# EAGLE schematic fab-chariot-elevateur (EAGLE 9.2.2)

## Sheet 1 of 3
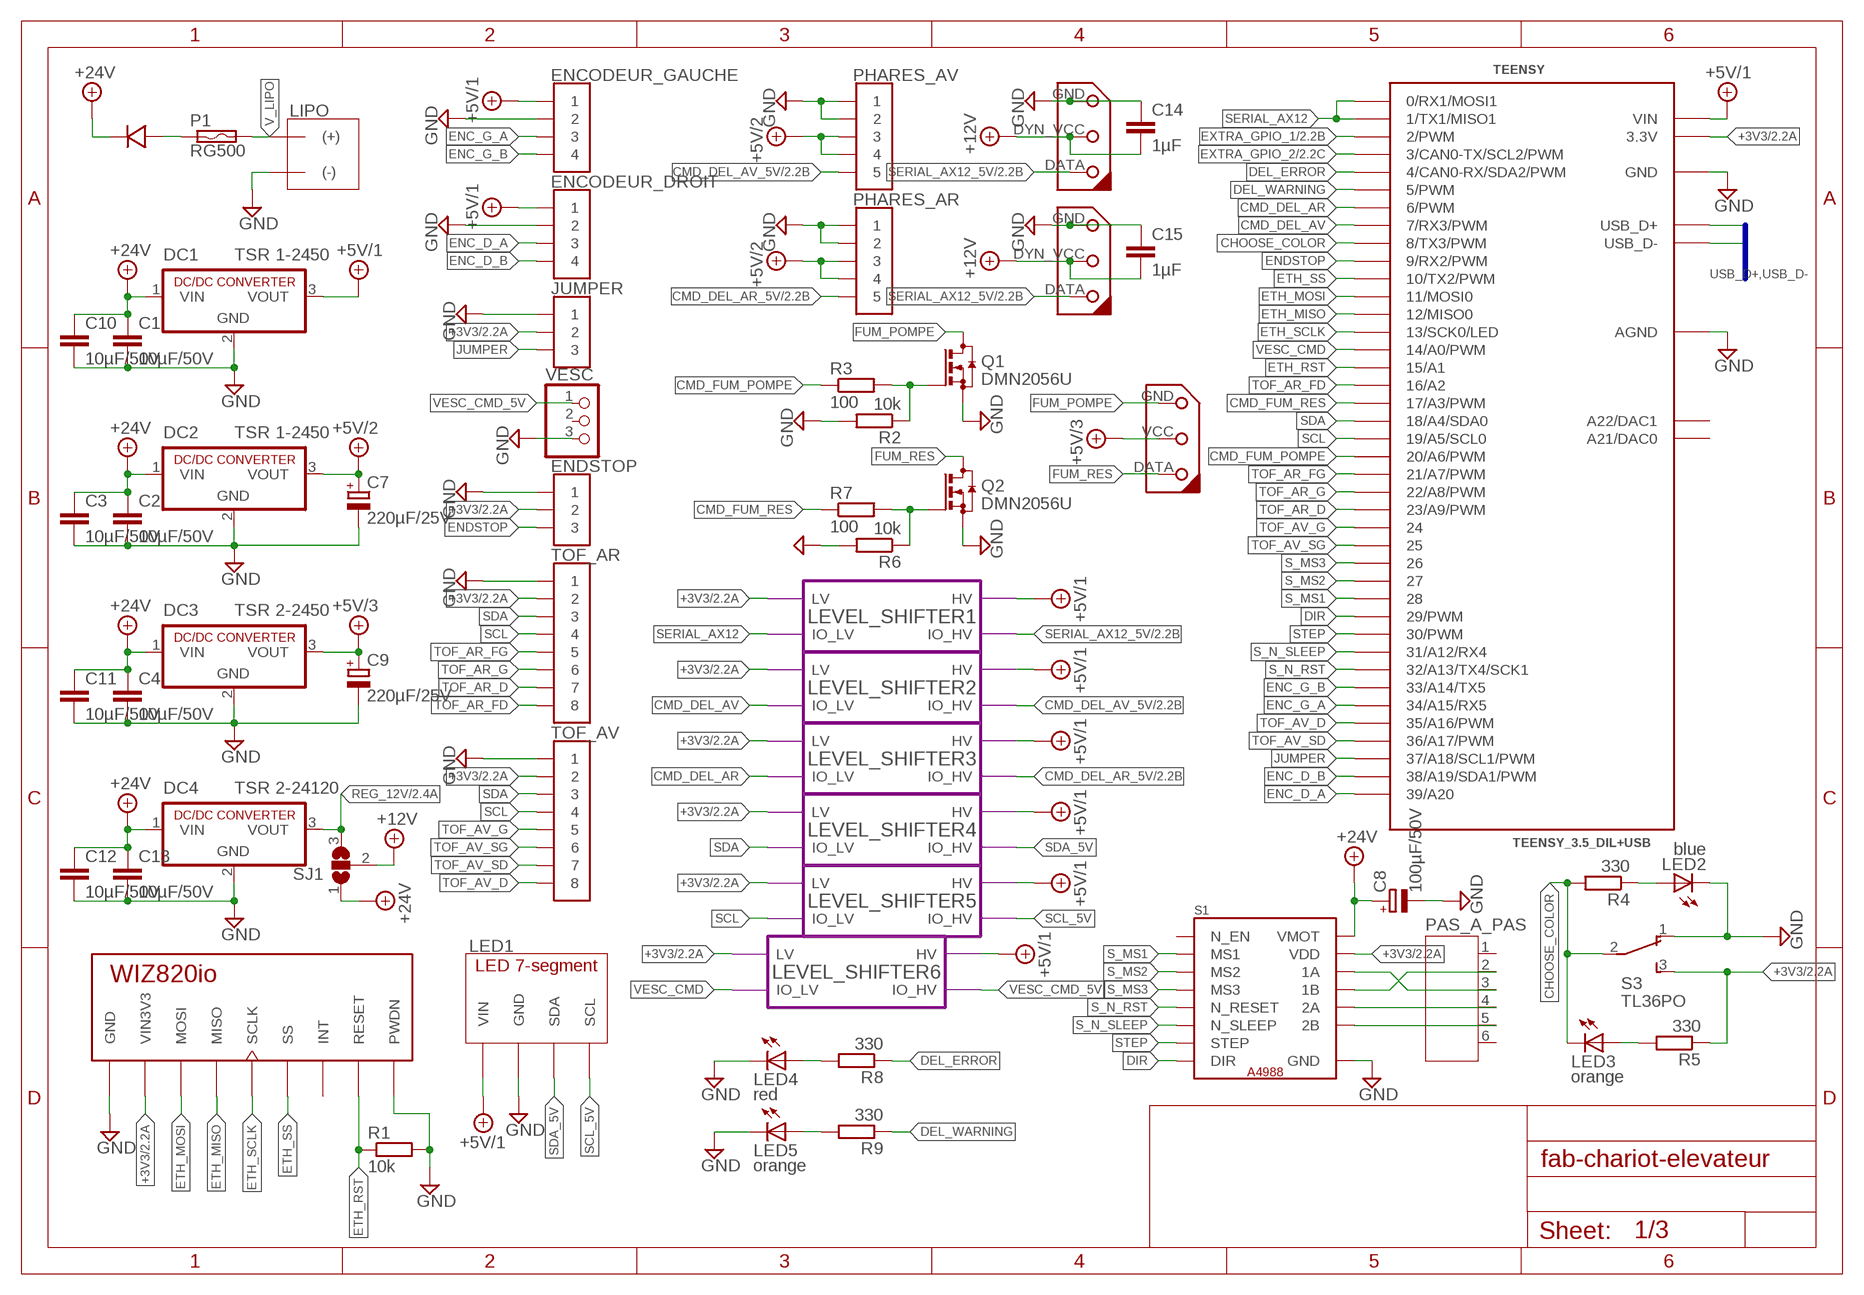
[diagram p0: schematic, sheet 1]

### Parts
AX12_AR  DYNAMIXEL-1X03AX  [DYNAMIXEL_AX_1X03]
AX12_AV  DYNAMIXEL-1X03AX  [DYNAMIXEL_AX_1X03]
C1  10µF/50V  C-EUC1210  [C1210]
C2  10µF/50V  C-EUC1210  [C1210]
C3  10µF/50V  C-EUC1210  [C1210]
C4  10µF/50V  C-EUC1210  [C1210]
C7  220µF/25V  CPOL-EUE3.5-8  [E3,5-8]
C8  100µF/50V  CPOL-EUE3.5-8  [E3,5-8]
C9  220µF/25V  CPOL-EUE3.5-8  [E3,5-8]
C10  10µF/50V  C-EUC1210  [C1210]
C11  10µF/50V  C-EUC1210  [C1210]
C12  10µF/50V  C-EUC1210  [C1210]
C13  10µF/50V  C-EUC1210  [C1210]
C14  1µF  C-EUC0805  [C0805]
C15  1µF  C-EUC0805  [C0805]
D1  DIODE_S15P45  [TO-277A]
DC1  TSR 1-2450  R-78C5.0-1.0  [SIP3]
DC2  TSR 1-2450  R-78C5.0-1.0  [SIP3]
DC3  TSR 2-2450  R-78C5.0-1.0  [SIP3]
DC4  TSR 2-24120  R-78C12-1.0  [SIP3]
ENCODEUR_DROIT  JST-04GH-V  [GH-04-V]
ENCODEUR_GAUCHE  JST-04GH-V  [GH-04-V]
ENDSTOP  JST-03  [GH-03-V]
FUMIGENE  DYNAMIXEL-1X03XL  [DYNAMIXEL_XL_1X03]
JUMPER  JST-03  [GH-03-V]
LED1  ADAFRUIT_7-SEGMENT-LED  [0.56"LED_BACKPACK]
LED2  blue  LEDSMT1206  [1206]
LED3  orange  LEDSMT1206  [1206]
LED4  red  LED3MM  [LED3MM]
LED5  orange  LED3MM  [LED3MM]
LIPO  XT-60  [XT-60]
P1  RG500  RGEF800  [5MM]
PAS_A_PAS  JST-PH6  [JST-PH6]
PHARES_AR  JST-05  [GH-05-V]
PHARES_AV  JST-05  [GH-05-V]
Q1  DMN2056U  BSS123  [SOT23]
Q2  DMN2056U  BSS123  [SOT23]
R1  10k  R-EU_R0805  [R0805]
R2  10k  R-EU_R0805  [R0805]
R3  100  R-EU_R0805  [R0805]
R4  330  R-EU_R0805  [R0805]
R5  330  R-EU_R0805  [R0805]
R6  10k  R-EU_R0805  [R0805]
R7  100  R-EU_R0805  [R0805]
R8  330  R-EU_R0805  [R0805]
R9  330  R-EU_R0805  [R0805]
S1  A4988-BREAKOUT  [A4988-BREAKOUT]
S3  TL36PO  [TL3XPO]
SJ1  SJ2W  [SJ_2]
TEENSY  TEENSY_3.5_DIL+USB  [TEENSY_3.5_DIL+USB]
TOF_AR  JST-08  [GH-08-V]
TOF_AV  JST-08  [GH-08-V]
U1  WIZ820IO  [WIZ820]
VESC  PINHD-1X3/90  [1X03/90]

### Module instances
LEVEL_SHIFTER1 = LEVEL_SHIFTER
LEVEL_SHIFTER2 = LEVEL_SHIFTER
LEVEL_SHIFTER3 = LEVEL_SHIFTER
LEVEL_SHIFTER4 = LEVEL_SHIFTER
LEVEL_SHIFTER5 = LEVEL_SHIFTER
LEVEL_SHIFTER6 = LEVEL_SHIFTER

### Nets
+3V3 [1A]: ENDSTOP.2 JUMPER.2 R5.1 S1.VDD S3.3(S) TEENSY.3.3V TEENSY.3.3V3(3.3V) TOF_AR.2 TOF_AV.2 U1.VIN1(VIN3V3) U1.VIN2(VIN3V3) ; port LEVEL_SHIFTER1.LV LEVEL_SHIFTER2.LV LEVEL_SHIFTER3.LV LEVEL_SHIFTER4.LV LEVEL_SHIFTER5.LV LEVEL_SHIFTER6.LV ; also sheet 2
+5V/1 [1A]: DC1.3(VOUT) ENCODEUR_DROIT.1 ENCODEUR_GAUCHE.1 LED1.VCC(VIN) TEENSY.VIN ; port LEVEL_SHIFTER1.HV LEVEL_SHIFTER4.HV LEVEL_SHIFTER5.HV LEVEL_SHIFTER6.HV LEVEL_SHIFTER2.HV LEVEL_SHIFTER3.HV ; also sheet 2
+5V/2 [2A]: C7.+ DC2.3(VOUT) PHARES_AR.3 PHARES_AR.4 PHARES_AV.3 PHARES_AV.4 ; also sheet 2
+5V/3 [2A]: C9.+ DC3.3(VOUT) FUMIGENE.VCC(DYN_VCC) ; also sheet 2
+12V [2A]: AX12_AR.DYN_VCC AX12_AV.DYN_VCC C14.2 C15.2 SJ1.2 ; also sheet 2
+24V [1A]: C1.1 C2.1 C3.1 C4.1 C8.+ C10.1 C11.1 C12.1 C13.1 D1.- DC1.1(VIN) DC2.1(VIN) DC3.1(VIN) DC4.1(VIN) S1.VMOT SJ1.1 ; also sheet 2
CHOOSE_COLOR: LED3.C R4.2 S3.2(P) TEENSY.8(8/TX3/PWM)
CMD_DEL_AR: TEENSY.6(6/PWM) ; port LEVEL_SHIFTER3.IO_LV
CMD_DEL_AR_5V: PHARES_AR.5 ; port LEVEL_SHIFTER3.IO_HV ; also sheet 2
CMD_DEL_AV: TEENSY.7(7/RX3/PWM) ; port LEVEL_SHIFTER2.IO_LV
CMD_DEL_AV_5V: PHARES_AV.5 ; port LEVEL_SHIFTER2.IO_HV ; also sheet 2
CMD_FUM_POMPE: R3.1 TEENSY.20/A6(20/A6/PWM)
CMD_FUM_RES: R7.1 TEENSY.17/A3(17/A3/PWM)
DEL_ERROR: R8.1 TEENSY.4(4/CAN0-RX/SDA2/PWM)
DEL_WARNING: R9.1 TEENSY.5(5/PWM)
DIR: S1.DIR TEENSY.29(29/PWM)
ENC_D_A: ENCODEUR_DROIT.3 TEENSY.39/A20
ENC_D_B: ENCODEUR_DROIT.4 TEENSY.38/A19(38/A19/SDA1/PWM)
ENC_G_A: ENCODEUR_GAUCHE.3 TEENSY.34/A15(34/A15/RX5)
ENC_G_B: ENCODEUR_GAUCHE.4 TEENSY.33/A14(33/A14/TX5)
ENDSTOP: ENDSTOP.3 TEENSY.9(9/RX2/PWM)
ETH_MISO: TEENSY.12(12/MISO0) U1.MISO
ETH_MOSI: TEENSY.11(11/MOSI0) U1.MOSI
ETH_RST: R1.1 TEENSY.15/A1 U1.RESET
ETH_SCLK: TEENSY.13(13/SCK0/LED) U1.SCLK
ETH_SS: TEENSY.10(10/TX2/PWM) U1.SS
EXTRA_GPIO_1: TEENSY.2(2/PWM) ; also sheet 2
EXTRA_GPIO_2: TEENSY.3(3/CAN0-TX/SCL2/PWM) ; also sheet 2
FUM_POMPE [2A]: FUMIGENE.GND Q1.3(D)
FUM_RES [2A]: FUMIGENE.DATA Q2.3(D)
GND: AX12_AR.GND AX12_AV.GND C1.2 C2.2 C3.2 C4.2 C7.- C8.- C9.- C10.2 C11.2 C12.2 C13.2 C14.1 C15.1 DC1.2(GND) DC2.2(GND) DC3.2(GND) DC4.2(GND) ENCODEUR_DROIT.2 ENCODEUR_GAUCHE.2 ENDSTOP.1 JUMPER.1 LED1.GND LED2.C LED4.K(C) LED5.K(C) LIPO.(-) PHARES_AR.1 PHARES_AR.2 PHARES_AV.1 PHARES_AV.2 Q1.2(S) Q2.2(S) R1.2 R2.2 R6.2 S1.GND1(GND) S1.GND2(GND) S3.1(O) TEENSY.AGND TEENSY.GND TEENSY.GND1(GND) TOF_AR.1 TOF_AV.1 U1.GND1(GND) U1.GND2(GND) U1.GND3(GND) U1.PWDN VESC.3 ; also sheet 2
JUMPER: JUMPER.3 TEENSY.37/A18(37/A18/SCL1/PWM)
N$1: LED4.A R8.2
N$2 [2A]: PAS_A_PAS.2 S1.1B
N$3 [2A]: PAS_A_PAS.3 S1.1A
N$4: D1.+1(+) D1.+2(+) P1.P$1
N$5 [2A]: PAS_A_PAS.4 S1.2A
N$6 [2A]: PAS_A_PAS.5 S1.2B
N$7: LED2.A R4.1
N$8: LED3.A R5.2
N$10: Q1.1(G) R2.1 R3.2
N$11: LED5.A R9.2
N$13: Q2.1(G) R6.1 R7.2
REG_12V [2A]: DC4.3(VOUT) SJ1.3 ; also sheet 2
S_MS1: S1.MS1 TEENSY.28
S_MS2: S1.MS2 TEENSY.27
S_MS3: S1.MS3 TEENSY.26
S_N_RST: S1.N_RST(N_RESET) TEENSY.32/A13(32/A13/TX4/SCK1)
S_N_SLEEP: S1.N_SLEEP TEENSY.31/A12(31/A12/RX4)
SCL: TEENSY.19/A5(19/A5/SCL0) TOF_AR.4 TOF_AV.4 ; port LEVEL_SHIFTER5.IO_LV
SCL_5V: LED1.SCL ; port LEVEL_SHIFTER5.IO_HV
SDA: TEENSY.18/A4(18/A4/SDA0) TOF_AR.3 TOF_AV.3 ; port LEVEL_SHIFTER4.IO_LV
SDA_5V: LED1.SDA ; port LEVEL_SHIFTER4.IO_HV
SERIAL_AX12: TEENSY.0(0/RX1/MOSI1) TEENSY.1(1/TX1/MISO1) ; port LEVEL_SHIFTER1.IO_LV
SERIAL_AX12_5V: AX12_AR.DATA AX12_AV.DATA ; port LEVEL_SHIFTER1.IO_HV ; also sheet 2
STEP: S1.STEP TEENSY.30(30/PWM)
TOF_AR_D: TEENSY.23/A9(23/A9/PWM) TOF_AR.7
TOF_AR_FD: TEENSY.16/A2 TOF_AR.8
TOF_AR_FG: TEENSY.21/A7(21/A7/PWM) TOF_AR.5
TOF_AR_G: TEENSY.22/A8(22/A8/PWM) TOF_AR.6
TOF_AV_D: TEENSY.35/A16(35/A16/PWM) TOF_AV.8
TOF_AV_G: TEENSY.24 TOF_AV.5
TOF_AV_SD: TEENSY.36/A17(36/A17/PWM) TOF_AV.7
TOF_AV_SG: TEENSY.25 TOF_AV.6
USB_D+: TEENSY.USBD+(USB_D+) ; also sheet 2
USB_D-: TEENSY.USBD-(USB_D-) ; also sheet 2
V_LIPO [5A]: LIPO.(+) P1.P$2
VESC_CMD: TEENSY.14/A0(14/A0/PWM) ; port LEVEL_SHIFTER6.IO_LV
VESC_CMD_5V: VESC.1 ; port LEVEL_SHIFTER6.IO_HV
Unconnected: PAS_A_PAS.1 PAS_A_PAS.6 S1.N_EN TEENSY.A21(A21/DAC0) TEENSY.A22(A22/DAC1) U1.INT VESC.2

### Buses
USB_D+,USB_D-

## Sheet 2 of 3
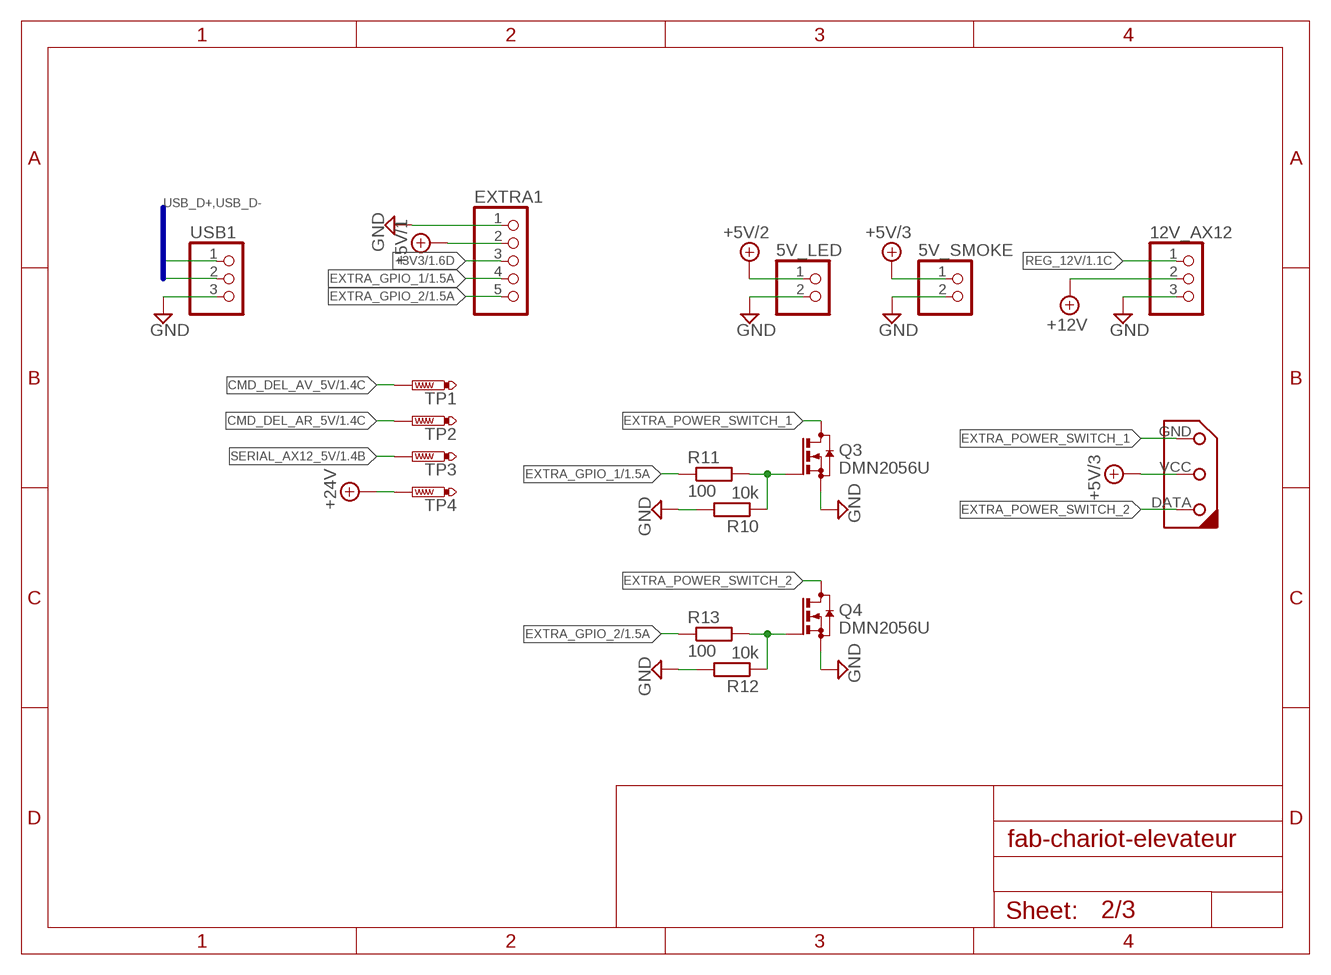
[diagram p1: schematic, sheet 2]

### Parts
5V_LED  PINHD-1X2  [1X02]
5V_SMOKE  PINHD-1X2  [1X02]
12V_AX12  PINHD-1X3  [1X03]
EXTRA  DYNAMIXEL-1X03XL  [DYNAMIXEL_XL_1X03]
EXTRA1  PINHD-1X5  [1X05]
Q3  DMN2056U  BSS123  [SOT23]
Q4  DMN2056U  BSS123  [SOT23]
R10  10k  R-EU_R0805  [R0805]
R11  100  R-EU_R0805  [R0805]
R12  10k  R-EU_R0805  [R0805]
R13  100  R-EU_R0805  [R0805]
TP1  PTR1PAD1-13  [P1-13]
TP2  PTR1PAD1-13  [P1-13]
TP3  PTR1PAD1-13  [P1-13]
TP4  PTR1PAD1-13  [P1-13]
USB1  PINHD-1X3  [1X03]

### Nets
+3V3 [1A]: EXTRA1.3 ; also sheet 1
+5V/1 [1A]: EXTRA1.2 ; also sheet 1
+5V/2 [2A]: 5V_LED.1 ; also sheet 1
+5V/3 [2A]: 5V_SMOKE.1 EXTRA.VCC(DYN_VCC) ; also sheet 1
+12V [2A]: 12V_AX12.2 ; also sheet 1
+24V [1A]: TP4.TP ; also sheet 1
CMD_DEL_AR_5V: TP2.TP ; also sheet 1
CMD_DEL_AV_5V: TP1.TP ; also sheet 1
EXTRA_GPIO_1: EXTRA1.4 R11.1 ; also sheet 1
EXTRA_GPIO_2: EXTRA1.5 R13.1 ; also sheet 1
EXTRA_POWER_SWITCH_1 [2A]: EXTRA.GND Q3.3(D)
EXTRA_POWER_SWITCH_2 [2A]: EXTRA.DATA Q4.3(D)
GND: 5V_LED.2 5V_SMOKE.2 12V_AX12.3 EXTRA1.1 Q3.2(S) Q4.2(S) R10.2 R12.2 USB1.3 ; also sheet 1
N$9: Q3.1(G) R10.1 R11.2
N$12: Q4.1(G) R12.1 R13.2
REG_12V [2A]: 12V_AX12.1 ; also sheet 1
SERIAL_AX12_5V: TP3.TP ; also sheet 1
USB_D+: USB1.1 ; also sheet 1
USB_D-: USB1.2 ; also sheet 1

### Buses
USB_D+,USB_D-

## Sheet 3 of 3
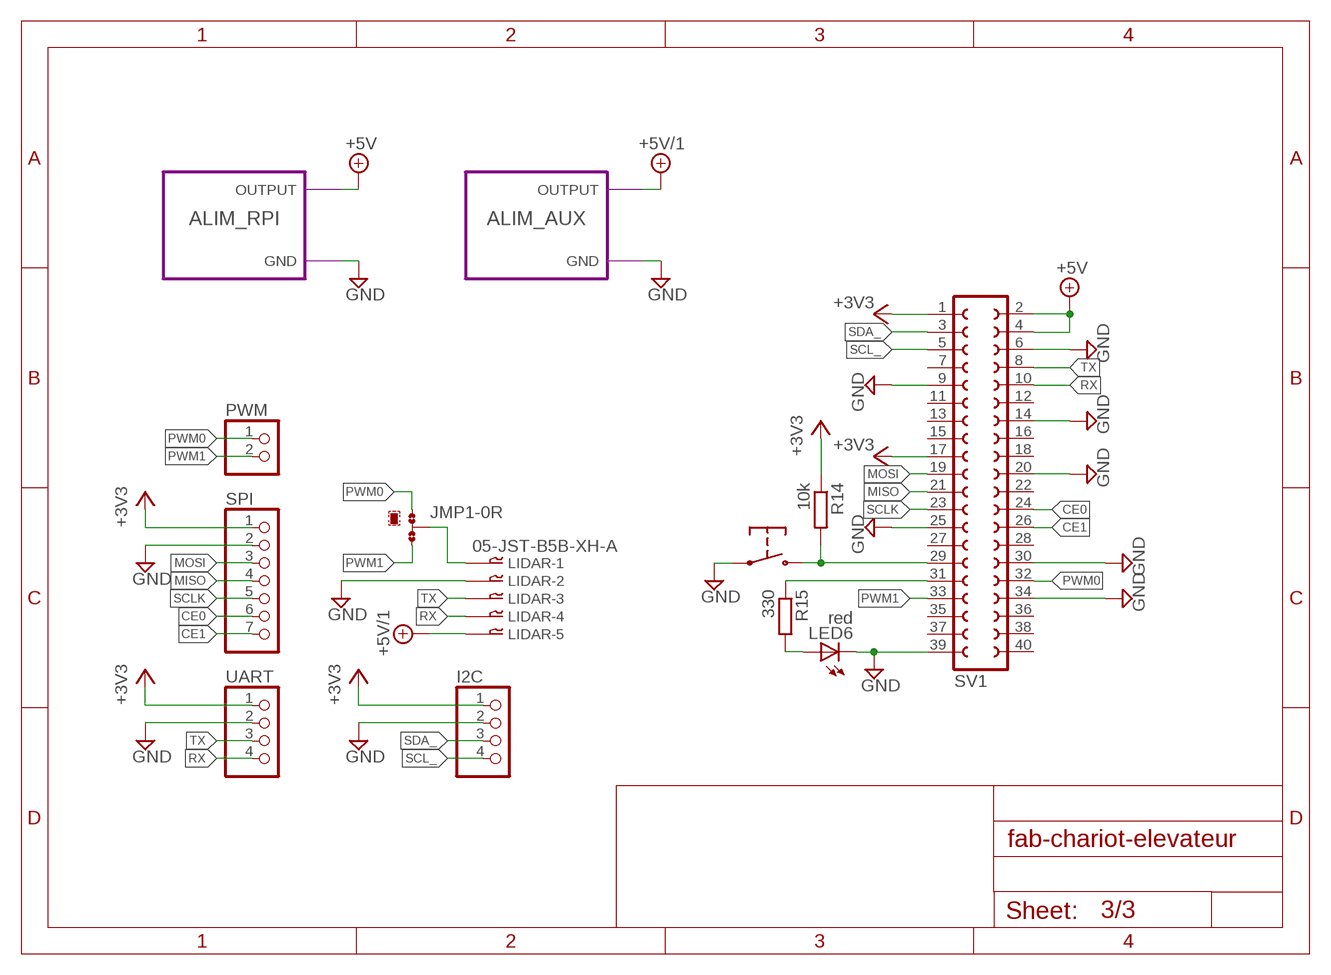
[diagram p2: schematic, sheet 3]

### Parts
I2C  PINHD-1X4  [1X04]
JMP1  0R-JUMPA  [A0R-JMP]
LED6  red  LEDSMT1206  [1206]
LIDAR  05-JST-B5B-XH-A  [B5B-XH]
PWM  PINHD-1X2  [1X02]
R14  10k  R-EU_R0805  [R0805]
R15  330  R-EU_R0805  [R0805]
SPI  PINHD-1X7  [1X07]
SV1  FE20-2  [FE20-2]
U$2  PUSH-BUTTON  [PUSH-BUTTON]
UART  PINHD-1X4  [1X04]

### Module instances
ALIM_RPI = 5V_ALIM
ALIM_AUX = 5V_ALIM

### Nets
+3V3_: I2C.1 R14.1 SPI.1 SV1.1 SV1.17 UART.1 ; supply symbol labelled +3V3
+5V: SV1.2 SV1.4 ; port ALIM_RPI.OUTPUT
+5V/1_: LIDAR.P$5 ; port ALIM_AUX.OUTPUT ; supply symbol labelled +5V/1
CE0: SPI.6 SV1.24
CE1: SPI.7 SV1.26
GND_: I2C.2 LED6.C LIDAR.P$2 SPI.2 SV1.6 SV1.9 SV1.14 SV1.20 SV1.25 SV1.30 SV1.34 SV1.39 U$2.1 U$2.2 UART.2 ; port ALIM_RPI.GND ALIM_AUX.GND ; supply symbol labelled GND
MISO: SPI.4 SV1.21
MOSI: SPI.3 SV1.19
N$14: R14.2 SV1.29 U$2.3 U$2.4
N$15: R15.1 SV1.31
N$16: LED6.A R15.2
N$17: JMP1.2 LIDAR.P$1
PWM0: JMP1.1 PWM.1 SV1.32
PWM1: JMP1.3 PWM.2 SV1.33
RX: LIDAR.P$4 SV1.10 UART.4
SCL_: I2C.4 SV1.5
SCLK: SPI.5 SV1.23
SDA_: I2C.3 SV1.3
TX: LIDAR.P$3 SV1.8 UART.3
Unconnected: SV1.7 SV1.11 SV1.12 SV1.13 SV1.15 SV1.16 SV1.18 SV1.22 SV1.27 SV1.28 SV1.35 SV1.36 SV1.37 SV1.38 SV1.40

## Library data of the parts
5V_LED 5V_SMOKE PWM = pinhead:PINHD-1X2: PIN HEADER
12V_AX12 USB1 VESC = pinhead:PINHD-1X3: PIN HEADER
AX12_AR AX12_AV = 1NTech_pinhead:DYNAMIXEL-1X03; RS: 687-8124; RS_AX: 687-8124; RS_XL: 688-3283
C1-C4 C10-C15 = resistor:C-EU: CAPACITOR, European symbol
C7-C9 = resistor:CPOL-EU: POLARIZED CAPACITOR, European symbol
D1 = diode_schottky:DIODE_S15P45; RS: 917-9118
DC1 DC2 = dc-dc-converter:R-78C*-1.0: INNOLINE DC/DC-Converter 1.0 AMP SIP3 Single Output Source: Data sheet <http://www.mikrocontroller.net/attachment/150645/157764-da-01-en-DC_DC_WANDLER_R_78C5_0_1_0.pdf>; RS: 666-4379
DC3 = dc-dc-converter:R-78C*-1.0: INNOLINE DC/DC-Converter 1.0 AMP SIP3 Single Output Source: Data sheet <http://www.mikrocontroller.net/attachment/150645/157764-da-01-en-DC_DC_WANDLER_R_78C5_0_1_0.pdf>; RS: 906-8487
DC4 = dc-dc-converter:R-78C*-1.0: INNOLINE DC/DC-Converter 1.0 AMP SIP3 Single Output Source: Data sheet <http://www.mikrocontroller.net/attachment/150645/157764-da-01-en-DC_DC_WANDLER_R_78C5_0_1_0.pdf>; RS: 906-8493
ENCODEUR_DROIT ENCODEUR_GAUCHE = con-jst:JST-04; RS: 752-1769; RS_F: 752-1731
ENDSTOP JUMPER = con-jst:JST-03; RS: 752-1765; RS_F: 752-1737
EXTRA FUMIGENE = 1NTech_pinhead:DYNAMIXEL-1X03; RS: 688-3283
EXTRA1 = pinhead:PINHD-1X5: PIN HEADER
I2C UART = pinhead:PINHD-1X4: PIN HEADER
JMP1 = jump-0r-smd:0R-JUMP: SMD 0R 0805 Jumper
LED1 = Adafruit-7-segment:ADAFRUIT_7-SEGMENT-LED; ADAFRUIT: 879
LED2 = led:LED: LED OSRAM: - CHIPLED LG R971, LG N971, LY N971, LG Q971, LY Q971, LO R971, LY R971 LH N974, LH R974 LS Q976, LO Q976, LY Q976 LO Q996 - Hyper CHIPLED LW Q18S LB Q993, LB Q99A, LB R99A - SideLED LS A670, LO A670, LY A670, LG A670, LP A670 LB A673, LV A673, LT A673, LW A673 LH A674 LY A675 LS A676, LA A676, LO A676, LY A676, LW A676 LS A679, LY A679, LG A679 - Hyper Micro SIDELED® LS Y876, LA Y876, LO Y876, LY Y876 LT Y87S - SmartLED LW L88C, LW L88S LB L89C, LB L89S, LG L890 LS L89K, LO L89K, LY L89K LS L896, LA L896, LO L896, LY L896 - TOPLED LS T670, LO T670, LY T670, LG T670, LP T670 LSG T670, LSP T670, LSY T670, LOP T670, LYG T670 LG T671, LOG T671, LSG T671 LB T673, LV T673, LT T673, LW T673 LH T674 LS T676, LA T676, LO T676, LY T676, LB T676, LH T676, LSB T676, LW T676 LB T67C, LV T67C, LT T67C, LS T67K, LO T67K, LY T67K, LW E67C LS E67B, LA E67B, LO E67B, LY E67B, LB E67C, LV E67C, LT E67C LW T67C LS T679, LY T679, LG T679 LS T770, LO T770, LY T770, LG T770, LP T770 LB T773, LV T773, LT T773, LW T773 LH T774 LS E675, LA E675, LY E675, LS T675 LS T776, LA T776, LO T776, LY T776, LB T776 LHGB T686 LT T68C, LB T68C - Hyper Mini TOPLED® LB M676 - Mini TOPLED Santana® LG M470 LS M47K, LO M47K, LY M47K Source: http://www.osram.convergy.de LUXEON: - LUMILED® LXK2-PW12-R00, LXK2-PW12-S00, LXK2-PW14-U00, LXK2-PW14-V00 LXK2-PM12-R00, LXK2-PM12-S00, LXK2-PM14-U00 LXK2-PE12-Q00, LXK2-PE12-R00, LXK2-PE12-S00, LXK2-PE14-T00, LXK2-PE14-U00 LXK2-PB12-K00, LXK2-PB12-L00, LXK2-PB12-M00, LXK2-PB14-N00, LXK2-PB14-P00, LXK2-PB14-Q00 LXK2-PR12-L00, LXK2-PR12-M00, LXK2-PR14-Q00, LXK2-PR14-R00 LXK2-PD12-Q00, LXK2-PD12-R00, LXK2-PD12-S00 LXK2-PH12-R00, LXK2-PH12-S00 LXK2-PL12-P00, LXK2-PL12-Q00, LXK2-PL12-R00 Source: www.luxeon.com KINGBRIGHT: KA-3528ASYC Source: www.kingbright.com; RS: 692-1073
LED3 = led:LED: LED OSRAM: - CHIPLED LG R971, LG N971, LY N971, LG Q971, LY Q971, LO R971, LY R971 LH N974, LH R974 LS Q976, LO Q976, LY Q976 LO Q996 - Hyper CHIPLED LW Q18S LB Q993, LB Q99A, LB R99A - SideLED LS A670, LO A670, LY A670, LG A670, LP A670 LB A673, LV A673, LT A673, LW A673 LH A674 LY A675 LS A676, LA A676, LO A676, LY A676, LW A676 LS A679, LY A679, LG A679 - Hyper Micro SIDELED® LS Y876, LA Y876, LO Y876, LY Y876 LT Y87S - SmartLED LW L88C, LW L88S LB L89C, LB L89S, LG L890 LS L89K, LO L89K, LY L89K LS L896, LA L896, LO L896, LY L896 - TOPLED LS T670, LO T670, LY T670, LG T670, LP T670 LSG T670, LSP T670, LSY T670, LOP T670, LYG T670 LG T671, LOG T671, LSG T671 LB T673, LV T673, LT T673, LW T673 LH T674 LS T676, LA T676, LO T676, LY T676, LB T676, LH T676, LSB T676, LW T676 LB T67C, LV T67C, LT T67C, LS T67K, LO T67K, LY T67K, LW E67C LS E67B, LA E67B, LO E67B, LY E67B, LB E67C, LV E67C, LT E67C LW T67C LS T679, LY T679, LG T679 LS T770, LO T770, LY T770, LG T770, LP T770 LB T773, LV T773, LT T773, LW T773 LH T774 LS E675, LA E675, LY E675, LS T675 LS T776, LA T776, LO T776, LY T776, LB T776 LHGB T686 LT T68C, LB T68C - Hyper Mini TOPLED® LB M676 - Mini TOPLED Santana® LG M470 LS M47K, LO M47K, LY M47K Source: http://www.osram.convergy.de LUXEON: - LUMILED® LXK2-PW12-R00, LXK2-PW12-S00, LXK2-PW14-U00, LXK2-PW14-V00 LXK2-PM12-R00, LXK2-PM12-S00, LXK2-PM14-U00 LXK2-PE12-Q00, LXK2-PE12-R00, LXK2-PE12-S00, LXK2-PE14-T00, LXK2-PE14-U00 LXK2-PB12-K00, LXK2-PB12-L00, LXK2-PB12-M00, LXK2-PB14-N00, LXK2-PB14-P00, LXK2-PB14-Q00 LXK2-PR12-L00, LXK2-PR12-M00, LXK2-PR14-Q00, LXK2-PR14-R00 LXK2-PD12-Q00, LXK2-PD12-R00, LXK2-PD12-S00 LXK2-PH12-R00, LXK2-PH12-S00 LXK2-PL12-P00, LXK2-PL12-Q00, LXK2-PL12-R00 Source: www.luxeon.com KINGBRIGHT: KA-3528ASYC Source: www.kingbright.com; RS: 726-9215
LED4 = led:LED: LED OSRAM: - CHIPLED LG R971, LG N971, LY N971, LG Q971, LY Q971, LO R971, LY R971 LH N974, LH R974 LS Q976, LO Q976, LY Q976 LO Q996 - Hyper CHIPLED LW Q18S LB Q993, LB Q99A, LB R99A - SideLED LS A670, LO A670, LY A670, LG A670, LP A670 LB A673, LV A673, LT A673, LW A673 LH A674 LY A675 LS A676, LA A676, LO A676, LY A676, LW A676 LS A679, LY A679, LG A679 - Hyper Micro SIDELED® LS Y876, LA Y876, LO Y876, LY Y876 LT Y87S - SmartLED LW L88C, LW L88S LB L89C, LB L89S, LG L890 LS L89K, LO L89K, LY L89K LS L896, LA L896, LO L896, LY L896 - TOPLED LS T670, LO T670, LY T670, LG T670, LP T670 LSG T670, LSP T670, LSY T670, LOP T670, LYG T670 LG T671, LOG T671, LSG T671 LB T673, LV T673, LT T673, LW T673 LH T674 LS T676, LA T676, LO T676, LY T676, LB T676, LH T676, LSB T676, LW T676 LB T67C, LV T67C, LT T67C, LS T67K, LO T67K, LY T67K, LW E67C LS E67B, LA E67B, LO E67B, LY E67B, LB E67C, LV E67C, LT E67C LW T67C LS T679, LY T679, LG T679 LS T770, LO T770, LY T770, LG T770, LP T770 LB T773, LV T773, LT T773, LW T773 LH T774 LS E675, LA E675, LY E675, LS T675 LS T776, LA T776, LO T776, LY T776, LB T776 LHGB T686 LT T68C, LB T68C - Hyper Mini TOPLED® LB M676 - Mini TOPLED Santana® LG M470 LS M47K, LO M47K, LY M47K Source: http://www.osram.convergy.de LUXEON: - LUMILED® LXK2-PW12-R00, LXK2-PW12-S00, LXK2-PW14-U00, LXK2-PW14-V00 LXK2-PM12-R00, LXK2-PM12-S00, LXK2-PM14-U00 LXK2-PE12-Q00, LXK2-PE12-R00, LXK2-PE12-S00, LXK2-PE14-T00, LXK2-PE14-U00 LXK2-PB12-K00, LXK2-PB12-L00, LXK2-PB12-M00, LXK2-PB14-N00, LXK2-PB14-P00, LXK2-PB14-Q00 LXK2-PR12-L00, LXK2-PR12-M00, LXK2-PR14-Q00, LXK2-PR14-R00 LXK2-PD12-Q00, LXK2-PD12-R00, LXK2-PD12-S00 LXK2-PH12-R00, LXK2-PH12-S00 LXK2-PL12-P00, LXK2-PL12-Q00, LXK2-PL12-R00 Source: www.luxeon.com KINGBRIGHT: KA-3528ASYC Source: www.kingbright.com; RS: 619-4886
LED5 = led:LED: LED OSRAM: - CHIPLED LG R971, LG N971, LY N971, LG Q971, LY Q971, LO R971, LY R971 LH N974, LH R974 LS Q976, LO Q976, LY Q976 LO Q996 - Hyper CHIPLED LW Q18S LB Q993, LB Q99A, LB R99A - SideLED LS A670, LO A670, LY A670, LG A670, LP A670 LB A673, LV A673, LT A673, LW A673 LH A674 LY A675 LS A676, LA A676, LO A676, LY A676, LW A676 LS A679, LY A679, LG A679 - Hyper Micro SIDELED® LS Y876, LA Y876, LO Y876, LY Y876 LT Y87S - SmartLED LW L88C, LW L88S LB L89C, LB L89S, LG L890 LS L89K, LO L89K, LY L89K LS L896, LA L896, LO L896, LY L896 - TOPLED LS T670, LO T670, LY T670, LG T670, LP T670 LSG T670, LSP T670, LSY T670, LOP T670, LYG T670 LG T671, LOG T671, LSG T671 LB T673, LV T673, LT T673, LW T673 LH T674 LS T676, LA T676, LO T676, LY T676, LB T676, LH T676, LSB T676, LW T676 LB T67C, LV T67C, LT T67C, LS T67K, LO T67K, LY T67K, LW E67C LS E67B, LA E67B, LO E67B, LY E67B, LB E67C, LV E67C, LT E67C LW T67C LS T679, LY T679, LG T679 LS T770, LO T770, LY T770, LG T770, LP T770 LB T773, LV T773, LT T773, LW T773 LH T774 LS E675, LA E675, LY E675, LS T675 LS T776, LA T776, LO T776, LY T776, LB T776 LHGB T686 LT T68C, LB T68C - Hyper Mini TOPLED® LB M676 - Mini TOPLED Santana® LG M470 LS M47K, LO M47K, LY M47K Source: http://www.osram.convergy.de LUXEON: - LUMILED® LXK2-PW12-R00, LXK2-PW12-S00, LXK2-PW14-U00, LXK2-PW14-V00 LXK2-PM12-R00, LXK2-PM12-S00, LXK2-PM14-U00 LXK2-PE12-Q00, LXK2-PE12-R00, LXK2-PE12-S00, LXK2-PE14-T00, LXK2-PE14-U00 LXK2-PB12-K00, LXK2-PB12-L00, LXK2-PB12-M00, LXK2-PB14-N00, LXK2-PB14-P00, LXK2-PB14-Q00 LXK2-PR12-L00, LXK2-PR12-M00, LXK2-PR14-Q00, LXK2-PR14-R00 LXK2-PD12-Q00, LXK2-PD12-R00, LXK2-PD12-S00 LXK2-PH12-R00, LXK2-PH12-S00 LXK2-PL12-P00, LXK2-PL12-Q00, LXK2-PL12-R00 Source: www.luxeon.com KINGBRIGHT: KA-3528ASYC Source: www.kingbright.com; RS: 127-8387
LED6 = led:LED: LED OSRAM: - CHIPLED LG R971, LG N971, LY N971, LG Q971, LY Q971, LO R971, LY R971 LH N974, LH R974 LS Q976, LO Q976, LY Q976 LO Q996 - Hyper CHIPLED LW Q18S LB Q993, LB Q99A, LB R99A - SideLED LS A670, LO A670, LY A670, LG A670, LP A670 LB A673, LV A673, LT A673, LW A673 LH A674 LY A675 LS A676, LA A676, LO A676, LY A676, LW A676 LS A679, LY A679, LG A679 - Hyper Micro SIDELED® LS Y876, LA Y876, LO Y876, LY Y876 LT Y87S - SmartLED LW L88C, LW L88S LB L89C, LB L89S, LG L890 LS L89K, LO L89K, LY L89K LS L896, LA L896, LO L896, LY L896 - TOPLED LS T670, LO T670, LY T670, LG T670, LP T670 LSG T670, LSP T670, LSY T670, LOP T670, LYG T670 LG T671, LOG T671, LSG T671 LB T673, LV T673, LT T673, LW T673 LH T674 LS T676, LA T676, LO T676, LY T676, LB T676, LH T676, LSB T676, LW T676 LB T67C, LV T67C, LT T67C, LS T67K, LO T67K, LY T67K, LW E67C LS E67B, LA E67B, LO E67B, LY E67B, LB E67C, LV E67C, LT E67C LW T67C LS T679, LY T679, LG T679 LS T770, LO T770, LY T770, LG T770, LP T770 LB T773, LV T773, LT T773, LW T773 LH T774 LS E675, LA E675, LY E675, LS T675 LS T776, LA T776, LO T776, LY T776, LB T776 LHGB T686 LT T68C, LB T68C - Hyper Mini TOPLED® LB M676 - Mini TOPLED Santana® LG M470 LS M47K, LO M47K, LY M47K Source: http://www.osram.convergy.de LUXEON: - LUMILED® LXK2-PW12-R00, LXK2-PW12-S00, LXK2-PW14-U00, LXK2-PW14-V00 LXK2-PM12-R00, LXK2-PM12-S00, LXK2-PM14-U00 LXK2-PE12-Q00, LXK2-PE12-R00, LXK2-PE12-S00, LXK2-PE14-T00, LXK2-PE14-U00 LXK2-PB12-K00, LXK2-PB12-L00, LXK2-PB12-M00, LXK2-PB14-N00, LXK2-PB14-P00, LXK2-PB14-Q00 LXK2-PR12-L00, LXK2-PR12-M00, LXK2-PR14-Q00, LXK2-PR14-R00 LXK2-PD12-Q00, LXK2-PD12-R00, LXK2-PD12-S00 LXK2-PH12-R00, LXK2-PH12-S00 LXK2-PL12-P00, LXK2-PL12-Q00, LXK2-PL12-R00 Source: www.luxeon.com KINGBRIGHT: KA-3528ASYC Source: www.kingbright.com
LIDAR = bt_con-jst-xh:05-JST: JST CONNECTOR
LIPO = con-xt:XT-60
P1 = polyswitch:RGEF800; RS: 817-1680
PAS_A_PAS = jst-ph:JST-PH6; RS: 820-1447; RS_F: 820-1481
PHARES_AR PHARES_AV = con-jst:JST-05; RS: 752-1778; RS_F: 752-1740
Q1-Q4 = transistor-small-signal:BSS123: N-CHANNEL MOS FET; RS: 133-3376
R1-R15 = resistor:R-EU_: RESISTOR, European symbol
S1 = stepper:A4988-BREAKOUT
S3 = switch:TL36PO: TINY SWITCH ON - ON Source: http://www2.produktinfo.conrad.com/datenblaetter/700000-724999/705152-da-01-de-Subminiaturschalter_TL_36YO.pdf; RS: 913-9069
SJ1 = jumper:SJ2W: SMD solder JUMPER
SPI = pinhead:PINHD-1X7: PIN HEADER
SV1 = con-lsta:FE20-2: FEMALE HEADER; OC_FARNELL: unknown; OC_NEWARK: unknown
TEENSY = Teensy_libSG:TEENSY_3.5_DIL+USB
TOF_AR TOF_AV = con-jst:JST-08; RS: 752-1775; RS_F: 752-1747
TP1-TP4 = testpad:PTR1: TEST PIN
U1 = wiznet:WIZ820IO; RS: 758-1032
U$2 = push-button:PUSH-BUTTON; RS: 479-1491

## Module LEVEL_SHIFTER
Ports: LV(io) IO_LV(io) HV(io) IO_HV(io)
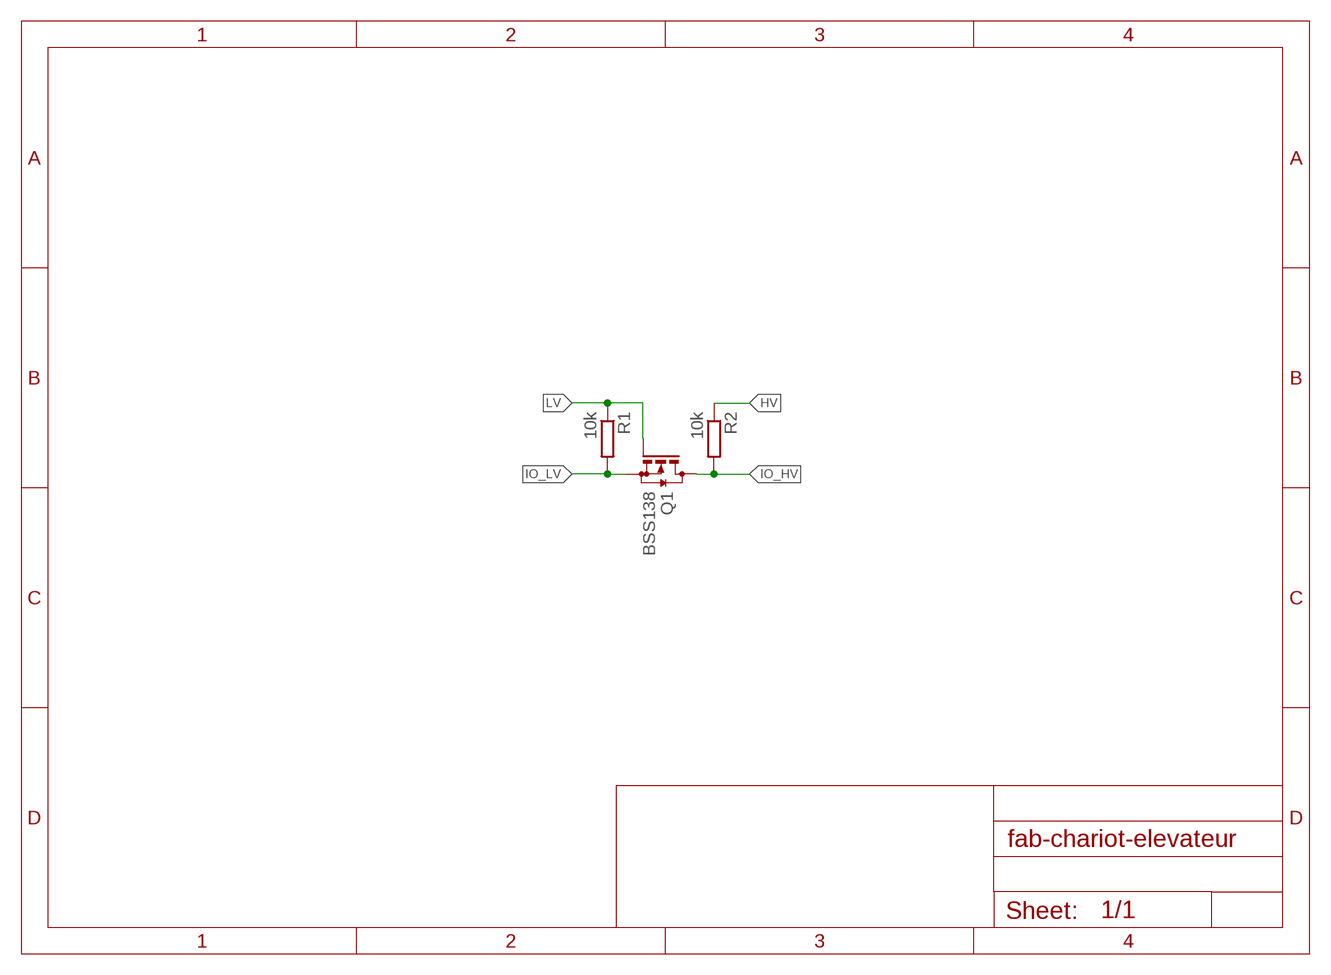
[diagram p3: schematic, module LEVEL_SHIFTER, sheet 1]

### Parts
Q1  BSS138  BSS123  [SOT23]
R1  10k  R-EU_R0805  [R0805]
R2  10k  R-EU_R0805  [R0805]

### Nets
HV: R2.1
IO_HV: Q1.3(D) R2.2
IO_LV: Q1.2(S) R1.2
LV: Q1.1(G) R1.1

### Library data of the parts
Q1 = transistor-small-signal:BSS123: N-CHANNEL MOS FET; RS: 669-7559
R1 R2 = resistor:R-EU_: RESISTOR, European symbol

## Module 5V_ALIM
Ports: OUTPUT(io) GND(io)
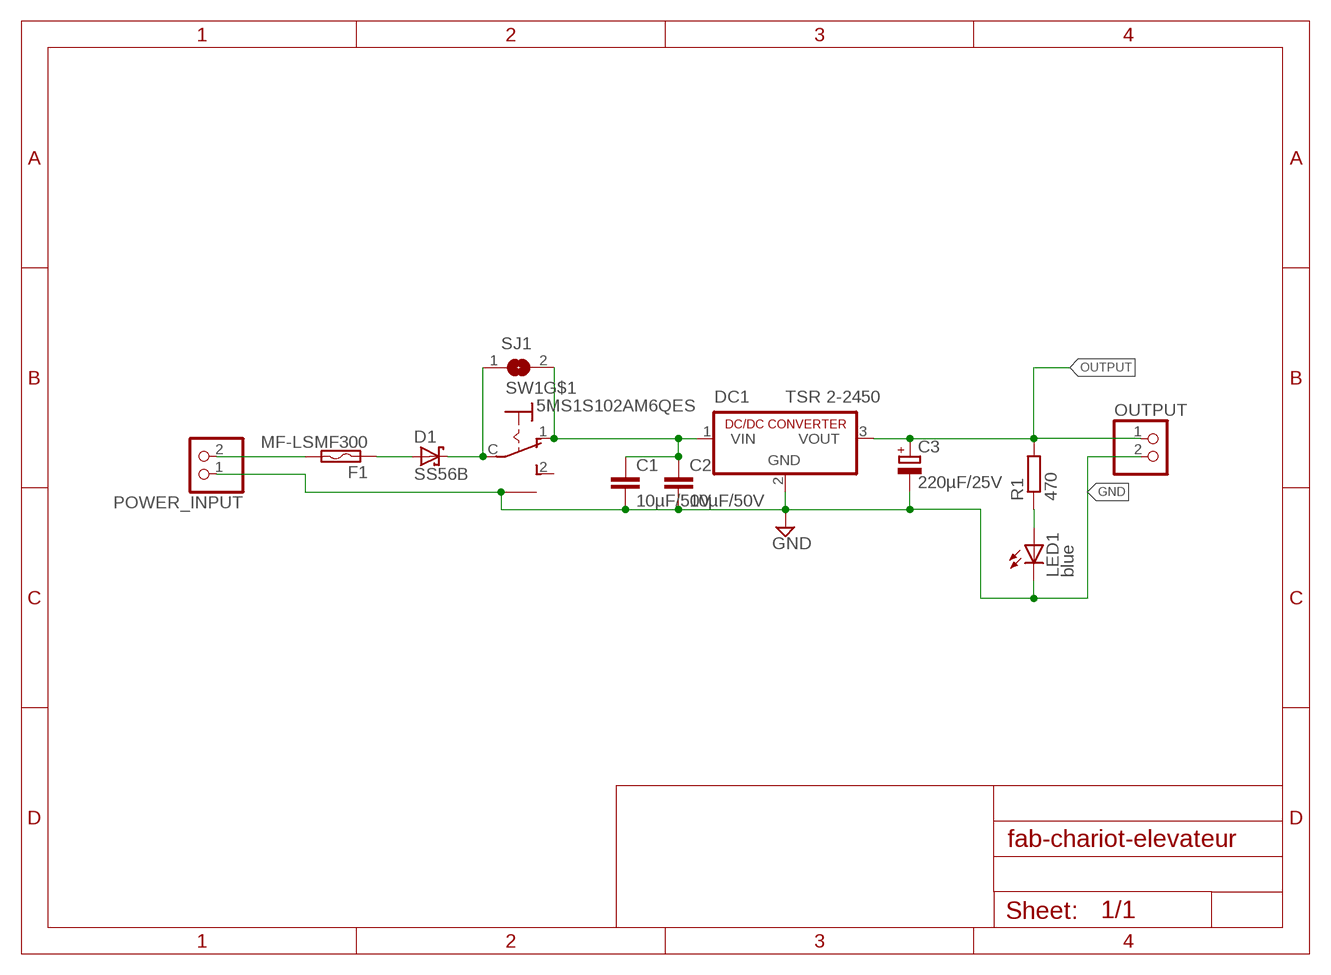
[diagram p4: schematic, module 5V_ALIM, sheet 1]

### Parts
C1  10µF/50V  C-EUC1210  [C1210]
C2  10µF/50V  C-EUC1210  [C1210]
C3  220µF/25V  CPOL-EUE3.5-8  [E3,5-8]
D1  SS56B  SCHOTTKY-DIODESMD  [SMB]
DC1  TSR 2-2450  R-78C5.0-1.0  [SIP3]
F1  MF-LSMF300  [MF-LSMF300]
LED1  blue  LEDSMT1206  [1206]
OUTPUT  PINHD-1X2  [1X02]
POWER_INPUT  PINHD-1X2  [1X02]
R1  470  R-EU_R0805  [R0805]
SJ1  SJ  [SJ]
SW1  5MS1S102AM6QES  [SPDT_SLIDE_SWITCH]

### Nets
GND: C1.2 C2.2 C3.- DC1.2(GND) LED1.C OUTPUT.2 POWER_INPUT.1 SW1.P$4(GND) SW1.P$5(GND)
N$1 [1A]: C1.1 C2.1 DC1.1(VIN) SJ1.2 SW1.1
N$3: LED1.A R1.1
N$4 [1A]: D1.C SJ1.1 SW1.C
N$6: D1.A F1.1
N$7: F1.2 POWER_INPUT.2
OUTPUT [2A]: C3.+ DC1.3(VOUT) OUTPUT.1 R1.2
Unconnected: SW1.2

### Library data of the parts
C1 C2 = resistor:C-EU: CAPACITOR, European symbol
C3 = resistor:CPOL-EU: POLARIZED CAPACITOR, European symbol
D1 = diode:SCHOTTKY-DIODE: Schottky Diode; RS: 917-9221
DC1 = dc-dc-converter:R-78C*-1.0: INNOLINE DC/DC-Converter 1.0 AMP SIP3 Single Output Source: Data sheet <http://www.mikrocontroller.net/attachment/150645/157764-da-01-en-DC_DC_WANDLER_R_78C5_0_1_0.pdf>; RS: 906-8487
F1 = polyswitch:MF-LSMF300: PolySwitch (TM) Resettable Device Source: Data sheet <http://www.farnell.com/datasheets/13482.pdf>; RS: 817-1652
LED1 = led:LED: LED OSRAM: - CHIPLED LG R971, LG N971, LY N971, LG Q971, LY Q971, LO R971, LY R971 LH N974, LH R974 LS Q976, LO Q976, LY Q976 LO Q996 - Hyper CHIPLED LW Q18S LB Q993, LB Q99A, LB R99A - SideLED LS A670, LO A670, LY A670, LG A670, LP A670 LB A673, LV A673, LT A673, LW A673 LH A674 LY A675 LS A676, LA A676, LO A676, LY A676, LW A676 LS A679, LY A679, LG A679 - Hyper Micro SIDELED® LS Y876, LA Y876, LO Y876, LY Y876 LT Y87S - SmartLED LW L88C, LW L88S LB L89C, LB L89S, LG L890 LS L89K, LO L89K, LY L89K LS L896, LA L896, LO L896, LY L896 - TOPLED LS T670, LO T670, LY T670, LG T670, LP T670 LSG T670, LSP T670, LSY T670, LOP T670, LYG T670 LG T671, LOG T671, LSG T671 LB T673, LV T673, LT T673, LW T673 LH T674 LS T676, LA T676, LO T676, LY T676, LB T676, LH T676, LSB T676, LW T676 LB T67C, LV T67C, LT T67C, LS T67K, LO T67K, LY T67K, LW E67C LS E67B, LA E67B, LO E67B, LY E67B, LB E67C, LV E67C, LT E67C LW T67C LS T679, LY T679, LG T679 LS T770, LO T770, LY T770, LG T770, LP T770 LB T773, LV T773, LT T773, LW T773 LH T774 LS E675, LA E675, LY E675, LS T675 LS T776, LA T776, LO T776, LY T776, LB T776 LHGB T686 LT T68C, LB T68C - Hyper Mini TOPLED® LB M676 - Mini TOPLED Santana® LG M470 LS M47K, LO M47K, LY M47K Source: http://www.osram.convergy.de LUXEON: - LUMILED® LXK2-PW12-R00, LXK2-PW12-S00, LXK2-PW14-U00, LXK2-PW14-V00 LXK2-PM12-R00, LXK2-PM12-S00, LXK2-PM14-U00 LXK2-PE12-Q00, LXK2-PE12-R00, LXK2-PE12-S00, LXK2-PE14-T00, LXK2-PE14-U00 LXK2-PB12-K00, LXK2-PB12-L00, LXK2-PB12-M00, LXK2-PB14-N00, LXK2-PB14-P00, LXK2-PB14-Q00 LXK2-PR12-L00, LXK2-PR12-M00, LXK2-PR14-Q00, LXK2-PR14-R00 LXK2-PD12-Q00, LXK2-PD12-R00, LXK2-PD12-S00 LXK2-PH12-R00, LXK2-PH12-S00 LXK2-PL12-P00, LXK2-PL12-Q00, LXK2-PL12-R00 Source: www.luxeon.com KINGBRIGHT: KA-3528ASYC Source: www.kingbright.com
OUTPUT POWER_INPUT = pinhead:PINHD-1X2: PIN HEADER
R1 = resistor:R-EU_: RESISTOR, European symbol
SJ1 = jumper:SJ: SMD solder JUMPER
SW1 = switch:5MS1S102AM6QES; PARTNO: *; REF-FAB: 5MS1S102AM6QES; REF-RS: 734-7296

## Net classes
1 5A: width 2.8 mm, drill 0.5 mm
2 2A: width 0.8 mm, drill 0.4 mm
3 1A: width 0.3 mm, drill 0.35 mm